# Altium project Riser 812 mod.2.PrjPcb (part 2 of 2)

## Sheet 5 External interface.SchDoc
size 594 x 420 mm; SheetNumber: 6; SheetTotal: 9
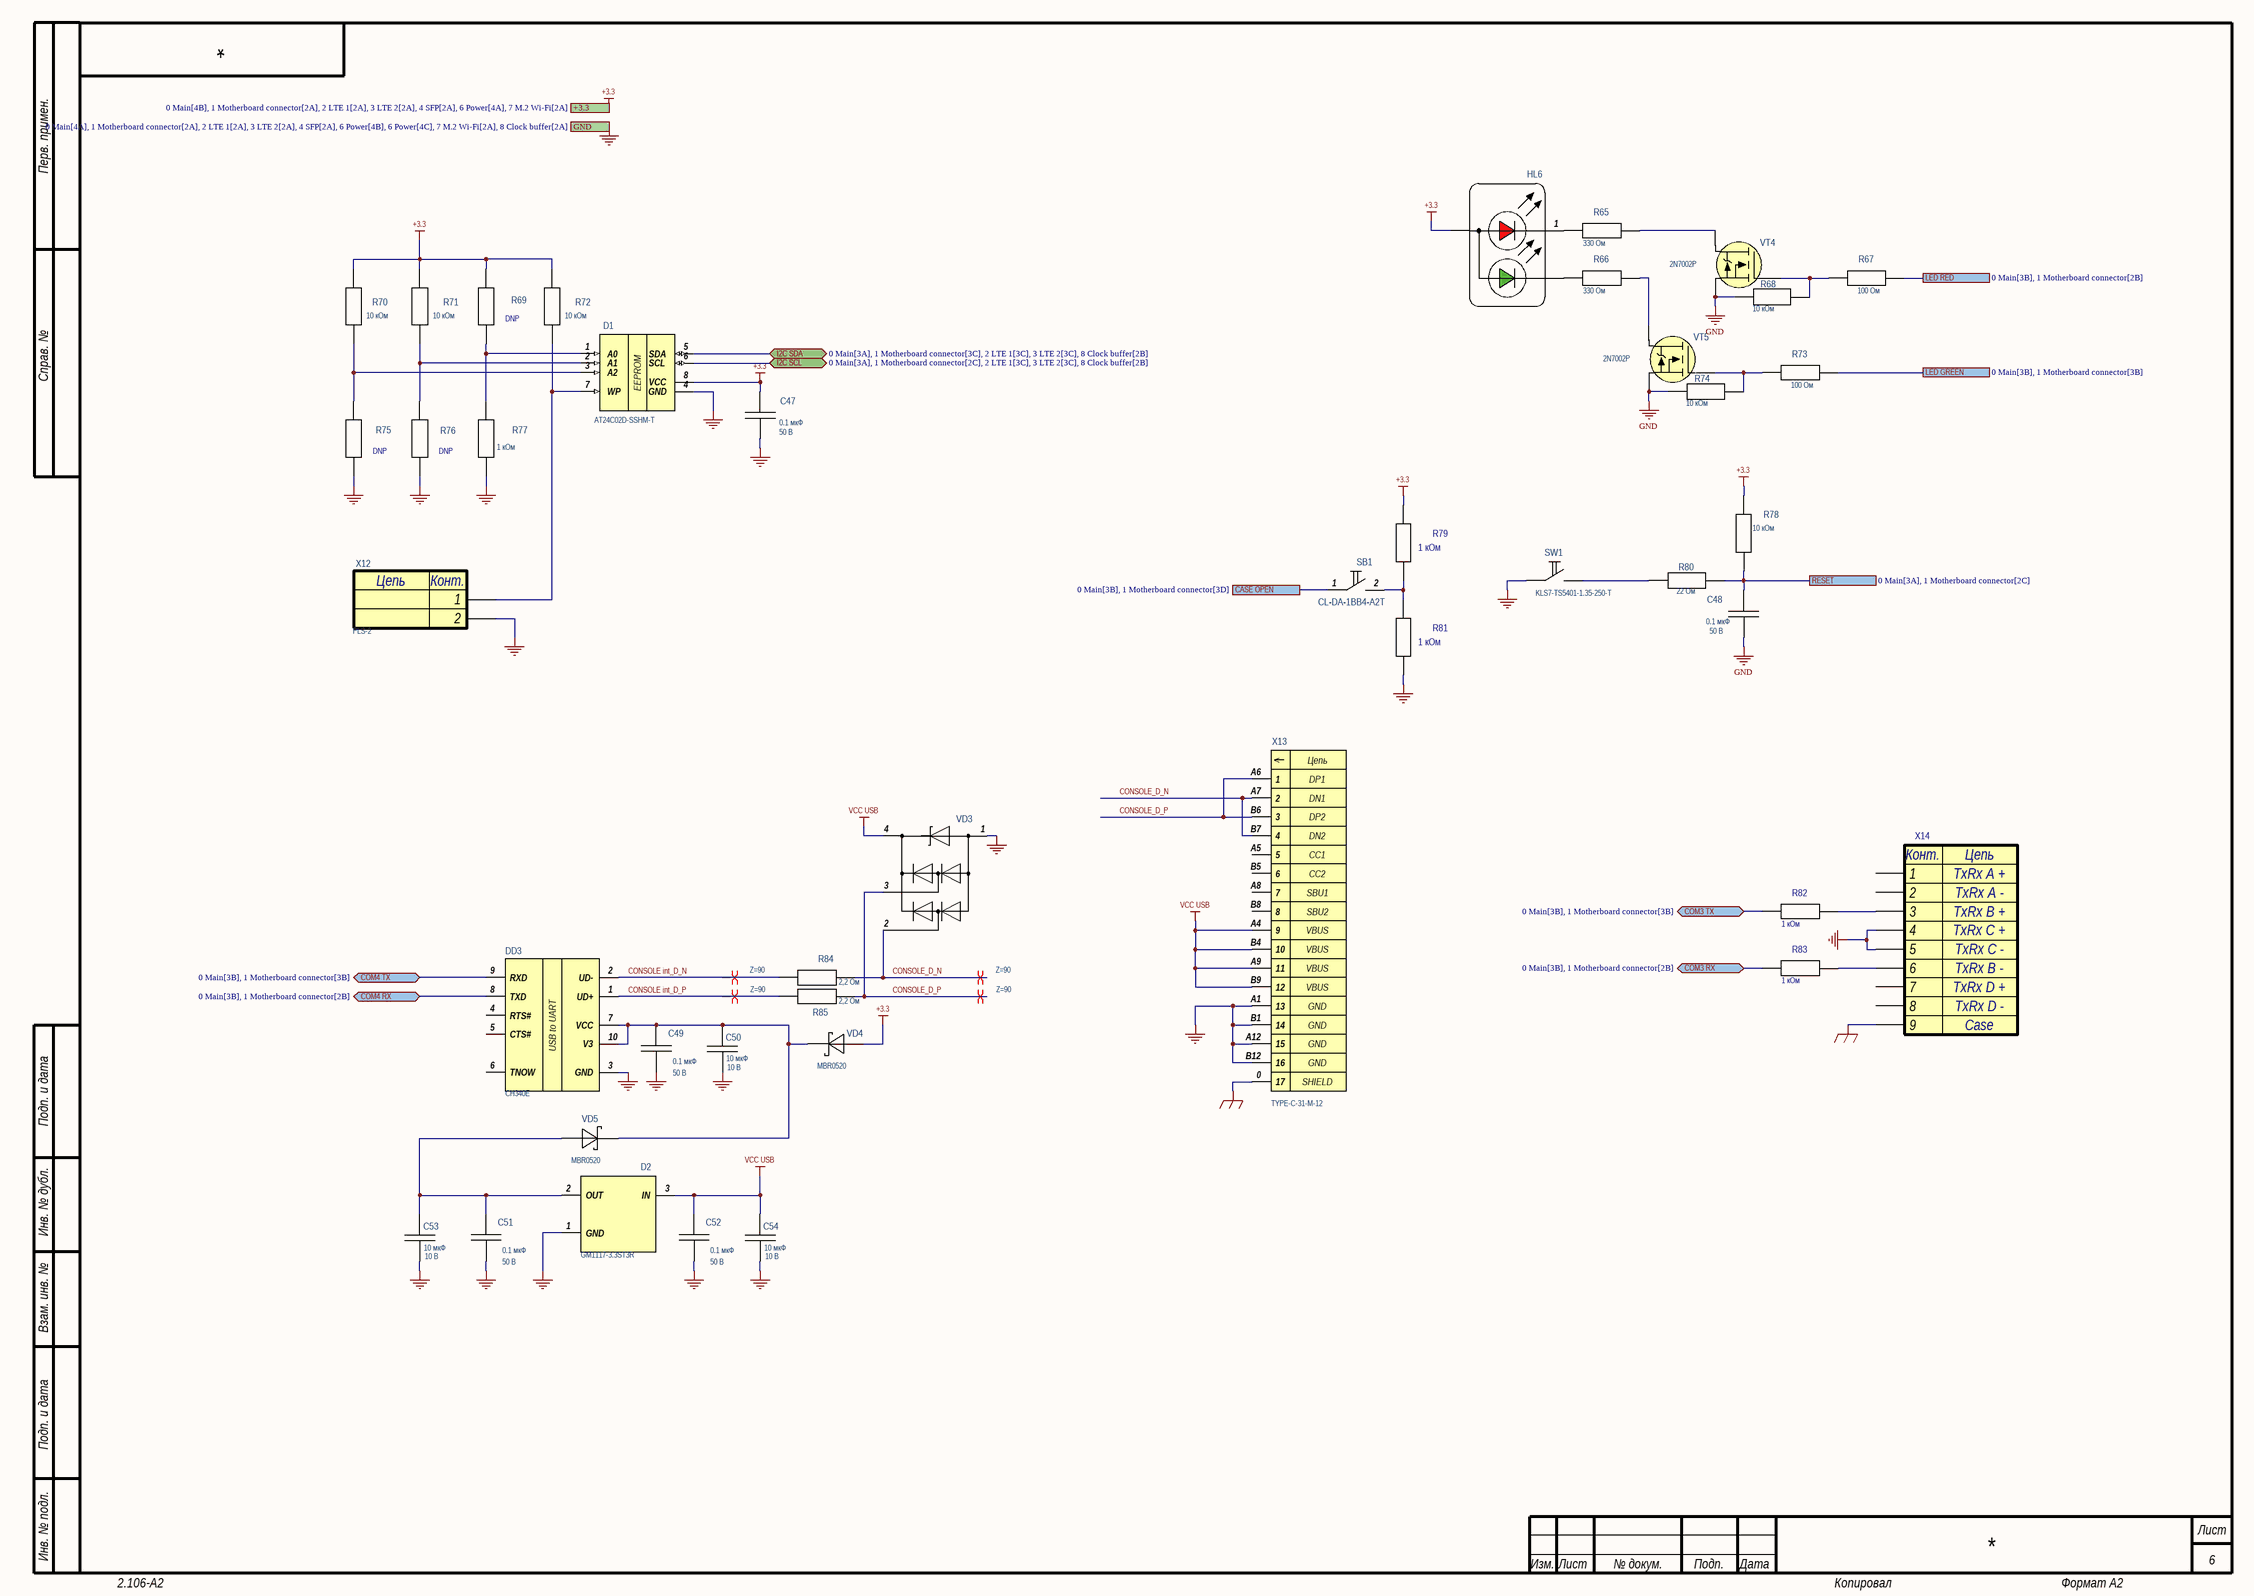
[diagram p5: 5 External interface.SchDoc]

### Parts
C47  value 0.1 мкФ  Напряжение: 50 В  [CAP_0402]
C48  value 0.1 мкФ  Напряжение: 50 В  [CAP_0402]
C49  value 0.1 мкФ  Напряжение: 50 В  [CAP_0402]
C50  value 10 мкФ  Напряжение: 10 В  [CAP_0603]
C51  value 0.1 мкФ  Напряжение: 50 В  [CAP_0402]
C52  value 0.1 мкФ  Напряжение: 50 В  [CAP_0402]
C53  value 10 мкФ  Напряжение: 10 В  [CAP_0603]
C54  value 10 мкФ  Напряжение: 10 В  [CAP_0603]
D1  AT24C02D-SSHM-T  [SOIC-8]
D2  GM1117-3.3ST3R  [SOT-223]
DD3  CH340E  [MSOP-10]
HL6  LTST-S326KGJRKT  [LTST-S326KGJRKT]  (value not drawn)
R65  value 330 Ом  [RES_0402]  (hidden comment: STD_RES)
R66  value 330 Ом  [RES_0402]  (hidden comment: STD_RES)
R67  value 100 Ом  [RES_0402]  (hidden comment: STD_RES)
R68  value 10 кОм  [RES_0402]  (hidden comment: STD_RES)
R69  STD_RES  [RES_0402]  (value not drawn)
R70  value 10 кОм  [RES_0402]  (hidden comment: STD_RES)
R71  value 10 кОм  [RES_0402]  (hidden comment: STD_RES)
R72  value 10 кОм  [RES_0402]  (hidden comment: STD_RES)
R73  value 100 Ом  [RES_0402]  (hidden comment: STD_RES)
R74  value 10 кОм  [RES_0402]  (hidden comment: STD_RES)
R75  STD_RES  [RES_0402]  (value not drawn)
R76  STD_RES  [RES_0402]  (value not drawn)
R77  value 1 кОм  [RES_0402]  (hidden comment: STD_RES)
R78  value 10 кОм  [RES_0402]  (hidden comment: STD_RES)
R79  value 1 кОм  [RES_0402]  (hidden comment: STD_RES)
R80  value 22 Ом  [RES_0402]  (hidden comment: STD_RES)
R81  value 1 кОм  [RES_0402]  (hidden comment: STD_RES)
R82  value 1 кОм  [RES_0402]  (hidden comment: STD_RES)
R83  value 1 кОм  [RES_0402]  (hidden comment: STD_RES)
R84  value 2,2 Ом  [RES_0402]  (hidden comment: STD_RES)
R85  value 2,2 Ом  [RES_0402]  (hidden comment: STD_RES)
SB1  CL-DA-1BB4-A2T  [CL-DA-1BB4-A2T]
SW1  KLS7-TS5401-1.35-250-T  [KLS7-TS5401-1.35-250-T]
VD3  WE05R  [SOT143]  (value not drawn)
VD4  PartNumber: MBR0520  [SOD123]  (hidden comment: STD_DIODE_SCHOTTKY)
VD5  PartNumber: MBR0520  [SOD123]  (hidden comment: STD_DIODE_SCHOTTKY)
VT4  2N7002P  [SOT-23-3]
VT5  2N7002P  [SOT-23-3]
X12  STD_CON2  [PLS-2]  (value not drawn)
X13  TYPE-C-31-M-12  [USB_TYPE_C_16_PIN_TYPE-C-31-M-12]
X14  DS1126-S80BP  [DS1126-S80BP]  (value not drawn)

### Ports
+3.3 (see 0 Main[4B], 1 Motherboard connector[2A], 2 LTE 1[2A], 3 LTE 2[2A], 4 SFP[2A], 6 Power[4A], 7 M.2 Wi-Fi[2A]), CASE OPEN (see 0 Main[3B], 1 Motherboard connector[3D]), COM3 RX (bidir, see 0 Main[3B], 1 Motherboard connector[2B]), COM3 TX (bidir, see 0 Main[3B], 1 Motherboard connector[3B]), COM4 RX (bidir, see 0 Main[3B], 1 Motherboard connector[2B]), COM4 TX (bidir, see 0 Main[3B], 1 Motherboard connector[3B]), GND (see 0 Main[4A], 1 Motherboard connector[2A], 2 LTE 1[2A], 3 LTE 2[2A], 4 SFP[2A], 6 Power[4B], 6 Power[4C], 7 M.2 Wi-Fi[2A], 8 Clock buffer[2A]), I2C SCL (bidir, see 0 Main[3A], 1 Motherboard connector[2C], 2 LTE 1[3C], 3 LTE 2[3C], 8 Clock buffer[2B]), I2C SDA (bidir, see 0 Main[3A], 1 Motherboard connector[3C], 2 LTE 1[3C], 3 LTE 2[3C], 8 Clock buffer[2B]), LED GREEN (see 0 Main[3B], 1 Motherboard connector[3B]), LED RED (see 0 Main[3B], 1 Motherboard connector[2B]), RESET (see 0 Main[3A], 1 Motherboard connector[2C])

### Nets
+3.3: C47.1 D1.8(VCC) HL6.3(A) R69.2 R70.2 R71.2 R72.2 R78.2 R79.1 VD4.2 ; port +3.3
GND: C47.2 C48.2 C49.2 C50.2 C51.2 C52.2 C53.2 C54.2 D1.4(GND) D2.1(GND) DD3.3(GND) R68.1 R74.1 R75.1 R76.1 R77.1 R81.2 SW1.1 VD3.1 VT4.2(S) VT5.2(S) X12.2 X13.A1(13) X13.A12(15) X13.B1(14) X13.B12(16) X14.4 X14.5 ; port GND
GNDG: X13.0(17) X14.9
VCC USB: C52.1 C54.1 D2.3(IN) VD3.4 X13.A4(9) X13.A9(11) X13.B4(10) X13.B9(12)
CONSOLE int_D_N: DD3.2(UD-) R84.1
CONSOLE int_D_P: DD3.1(UD+) R85.1
CONSOLE_D_N: R84.2 VD3.2 X13.A7(2) X13.B7(4)
CONSOLE_D_P: R85.2 VD3.3 X13.A6(1) X13.B6(3)
NetC48_1: C48.1 R78.1 R80.1 ; port RESET
NetC49_1: C49.1 C50.1 DD3.7(VCC) DD3.10(V3) VD4.1 VD5.1
NetC51_1: C51.1 C53.1 D2.2(OUT) VD5.2
NetD1_1: D1.1(A0) R69.1 R77.2
NetD1_2: D1.2(A1) R71.1 R76.2
NetD1_3: D1.3(A2) R70.1 R75.2
NetD1_5: D1.5(SDA) ; port I2C SDA
NetD1_6: D1.6(SCL) ; port I2C SCL
NetD1_7: D1.7(WP) R72.1 X12.1
NetDD3_8: DD3.8(TXD) ; port COM4 RX
NetDD3_9: DD3.9(RXD) ; port COM4 TX
NetHL6_1: HL6.1(K) R65.1
NetHL6_2: HL6.2(K) R66.1
NetR65_2: R65.2 VT4.3(D)
NetR66_2: R66.2 VT5.3(D)
NetR67_1: R67.1 R68.2 VT4.1(G)
NetR67_2: R67.2 ; port LED RED
NetR73_1: R73.1 R74.2 VT5.1(G)
NetR73_2: R73.2 ; port LED GREEN
NetR79_2: R79.2 R81.1 SB1.2
NetR80_2: R80.2 SW1.2
NetR82_1: R82.1 ; port COM3 TX
NetR82_2: R82.2 X14.3
NetR83_1: R83.1 ; port COM3 RX
NetR83_2: R83.2 X14.6
NetSB1_1: SB1.1 ; port CASE OPEN

Not connected (* = marked no-connect by the designer): DD3 4(RTS#) 5(CTS#) 6(TNOW); X13 A5(5) A8(7) B5(6) B8(8); X14 1 2 7 8

### Layout directives
differential pair; differential pair class Z=90: CONSOLE int_D_N, CONSOLE int_D_P, CONSOLE_D_N, CONSOLE_D_P

### Notes on the sheet
- (near R69) DNP
- (near R75) DNP
- (near R76) DNP
- Перв. примен.
- Справ. №
- Подп. и дата
- Инв. № дубл.
- Взам. инв. №
- Инв. № подл.
- Изм.
- Лист
- № докум.
- Подп.
- Дата
- 2.106-A2
- Копировал
- Формат А2
- (in symbol AT24C02D-SSHM-T) EEPROM
- (in symbol DS1126-S80BP) Конт.; Цепь; TxRx A +; TxRx A -; TxRx B +; TxRx C +; TxRx C -; TxRx B -; TxRx D +; TxRx D -; Case
- (in symbol PLS-2) Цепь; Конт.
- (in symbol TYPE-C-31-M-12) Цепь; DP1; DN1; DP2; DN2; CC1; CC2; SBU1; SBU2; VBUS; GND; SHIELD

### Library data of the parts
C47-C49 C51 C52 = CC0402KRX7R9BB104: as C55 on sheet 6 Power; PartNumber: CC0402KRX7R9BB104; Type: CHIP-0402; Tolerance: 10%; Диэлектрик: X7R; Data: 10-04-2024
C50 C53 C54 = GRM188Z71A106KA73D: Конденсатор CHIP-0603 10 мкФ 10 В 10% X7R; Manufacturer: MURATA; ID: 394; Температура: -55...+155°C; Autor: Admin; PartNumber: GRM188Z71A106KA73D; Type: CHIP-0603; Tolerance: 10%; Диэлектрик: X7R; Data: 08-26-2025
D1 = AT24C02D-SSHM-T: Микросхема Atmel  EEPROM 2K I2C 1MHZ; ID: 751; Type: Memory; Voltage: 1.7-3.6В; Current: 3 мА; Температура: -40...+85°C; Autor: Admin; PartNumber: AT24C02D-SSHM-T; Value: EEPROM 2K I2C 1MHZ; Manufacturer: Atmel; Data: 05-31-2024
D2 = GM1117-3.3ST3R: Микросхема Gamma Electronica  1.0 A Low-Dropout LDO; ID: 750; Type: LDOs; Voltage: 3.3В; Current: 1 А; Температура: 0...+125°C; Autor: Admin; PartNumber: GM1117-3.3ST3R; Value: 1.0 A Low-Dropout LDO; Manufacturer: Gamma Electronica; Data: 05-23-2024
DD3 = CH340E: Микросхема MPJA USB to UART; ID: 734; Voltage: 5В; Current: 100 мА; Температура: -40...+85°C; Autor: Admin; Component Type: Микросхема; PartNumber: CH340E; Type: Interfaces; Value: USB to UART; Manufacturer: MPJA; Data: 11-13-2023
HL6 = LTST-S326KGJRKT: Диод LITEON 2 В 30 мА; ID: 122; Type: LED; U_direct: 2 В; U_reverse: 5 В; Current: 30 мА; Температура: -40...+85°C; Autor: Admin; PartNumber: LTST-S326KGJRKT; Manufacturer: LITEON; Data: 01-11-2021
R65 R66 = RC0402FR-07330RL: Резистор CHIP-0402 330 Ом 1%; Manufacturer: YAGEO; ID: 319; ТКС: 100 ppm/K; Температура: -55...+155°C; Autor: Цислав А.Н.; PartNumber: RC0402FR-07330RL; Type: CHIP-0402; Tolerance: 1%; Data: 02-03-2014
R67 R73 = RC0402FR-07100RL: Резистор CHIP-0402 100 Ом 1%; Manufacturer: YAGEO; ID: 298; ТКС: 100 ppm/K; Температура: -55...+155°C; Autor: Цислав А.Н.; PartNumber: RC0402FR-07100RL; Type: CHIP-0402; Tolerance: 1%; Data: 02-03-2014
R68 R70-R72 R74 R78 = RC0402FR-0710KL: Резистор CHIP-0402 10 кОм 1%; Manufacturer: YAGEO; ID: 412; ТКС: 100 ppm/K; Температура: -55...+155°C; Autor: Цислав А.Н.; PartNumber: RC0402FR-0710KL; Type: CHIP-0402; Tolerance: 1%; Data: 02-03-2014
R69 R75 R76 = RC0402FR-0710KL: Резистор CHIP-0402 10 кОм 1%; Manufacturer: YAGEO; ID: 412; Value: 10 кОм; ТКС: 100 ppm/K; Температура: -55...+155°C; Autor: Цислав А.Н.; PartNumber: RC0402FR-0710KL; Type: CHIP-0402; Tolerance: 1%; Data: 02-03-2014
R77 R79 R81 = RC0402FR-071KL: Резистор CHIP-0402 1 кОм 1%; Manufacturer: YAGEO; ID: 337; ТКС: 100 ppm/K; Температура: -55...+155°C; Autor: Цислав А.Н.; PartNumber: RC0402FR-071KL; Type: CHIP-0402; Tolerance: 1%; Data: 02-03-2014
R80 = RC0402FR-0722RL: as R3 on sheet 2 LTE 1; PartNumber: RC0402FR-0722RL; Type: CHIP-0402; Tolerance: 1%; Data: 02-03-2014
R82 R83 = RC0402JR-071KL: Резистор CHIP-0402 1 кОм 5%; Manufacturer: YAGEO; ID: 338; ТКС: 100 ppm/K; Температура: -55...+155°C; Autor: Цислав А.Н.; PartNumber: RC0402JR-071KL; Type: CHIP-0402; Tolerance: 5%; Data: 02-03-2014
R84 R85 = RC0402FR-072R2L: Резистор CHIP-0402 2,2 Ом 1%; Manufacturer: YAGEO; ID: 733; ТКС: 200 ppm/K; Температура: -55...+155°C; Autor: Admin; PartNumber: RC0402FR-072R2L; Type: CHIP-0402; Tolerance: 1%; Data: 11-08-2023
SB1 = CL-DA-1BB4-A2T: Copal Electronics  DETECT SWITCH right angle NC; ID: 98; Voltage: 12 B; Current: 100 мА; Температура: -40...+85°C; Autor: Admin; PartNumber: CL-DA-1BB4-A2T; Type: BUTTON; Value: DETECT SWITCH right angle NC; Manufacturer: Copal Electronics; Data: 05-15-2018
SW1 = KLS7-TS5401-1.35-250-T: KLS Угловая кнопка тактовая SMD; ID: 155; Voltage: 12V; Current: 50 мА; Температура: -30...+70°C; Autor: Admin; PartNumber: KLS7-TS5401-1.35-250-T; Type: BUTTON; Value: Угловая кнопка тактовая SMD; Manufacturer: KLS; Data: 04-09-2024
VD3 = WE05R: Диод WAYON 5 В 5 А; ID: 126; Type: Diode TVS; U_direct: 5 В; Current: 5 А; Температура: -55...+125°C; Autor: Admin; PartNumber: WE05R; U_reverse: 5 В; Manufacturer: WAYON; Data: 12-08-2023
VD4 VD5 = MBR0520: Диод IR 500 мВ 500 мА; ID: 33; Type: Diode Schottky; U_direct: 500 мВ; U_reverse: 20 В; Current: 500 мА; Температура: -40...+85°C; Autor: Admin; Manufacturer: IR; Data: 10-22-2015
VT4 VT5 = 2N7002P: Микросхема NXP  N-channel Trench MOSFET; ID: 321; Type: MOSFET N-Channel; Voltage: 60В; Current: 300 мА; Температура: -40...+85°C; Autor: Admin; PartNumber: 2N7002P; Value: N-channel Trench MOSFET; Manufacturer: NXP; Data: 05-24-2016
X12 = PLS-2: Разъем NoName PLS; ID: 2; Pitch: 2.54 мм; Current: 2 А; Autor: Admin; PartNumber: PLS-2; Type: PLS; Contact: 2; Mounting: Сквозной; Manufacturer: NoName; Data: 09-04-2013
X13 = TYPE-C-31-M-12: Разъем Hroparts Electronics USB; ID: 375; Contact: 14; Pitch: 0.5 мм; Current: 1 А; Autor: Admin; PartNumber: TYPE-C-31-M-12; Type: USB; Mounting: Поверхностный; Manufacturer: Hroparts Electronics; Data: 05-13-2024
X14 = DS1126-S80BP: Разъем Connfly LAN; ID: 364; Contact: 8; Pitch: 1.27 мм; Current: 1 А; Autor: Admin; PartNumber: DS1126-S80BP; Type: LAN; Mounting: Сквозной; Manufacturer: Connfly; Data: 04-04-2024

## Sheet 1 Motherboard connector.SchDoc
size 420 x 297 mm; SheetNumber: 2; SheetTotal: 9
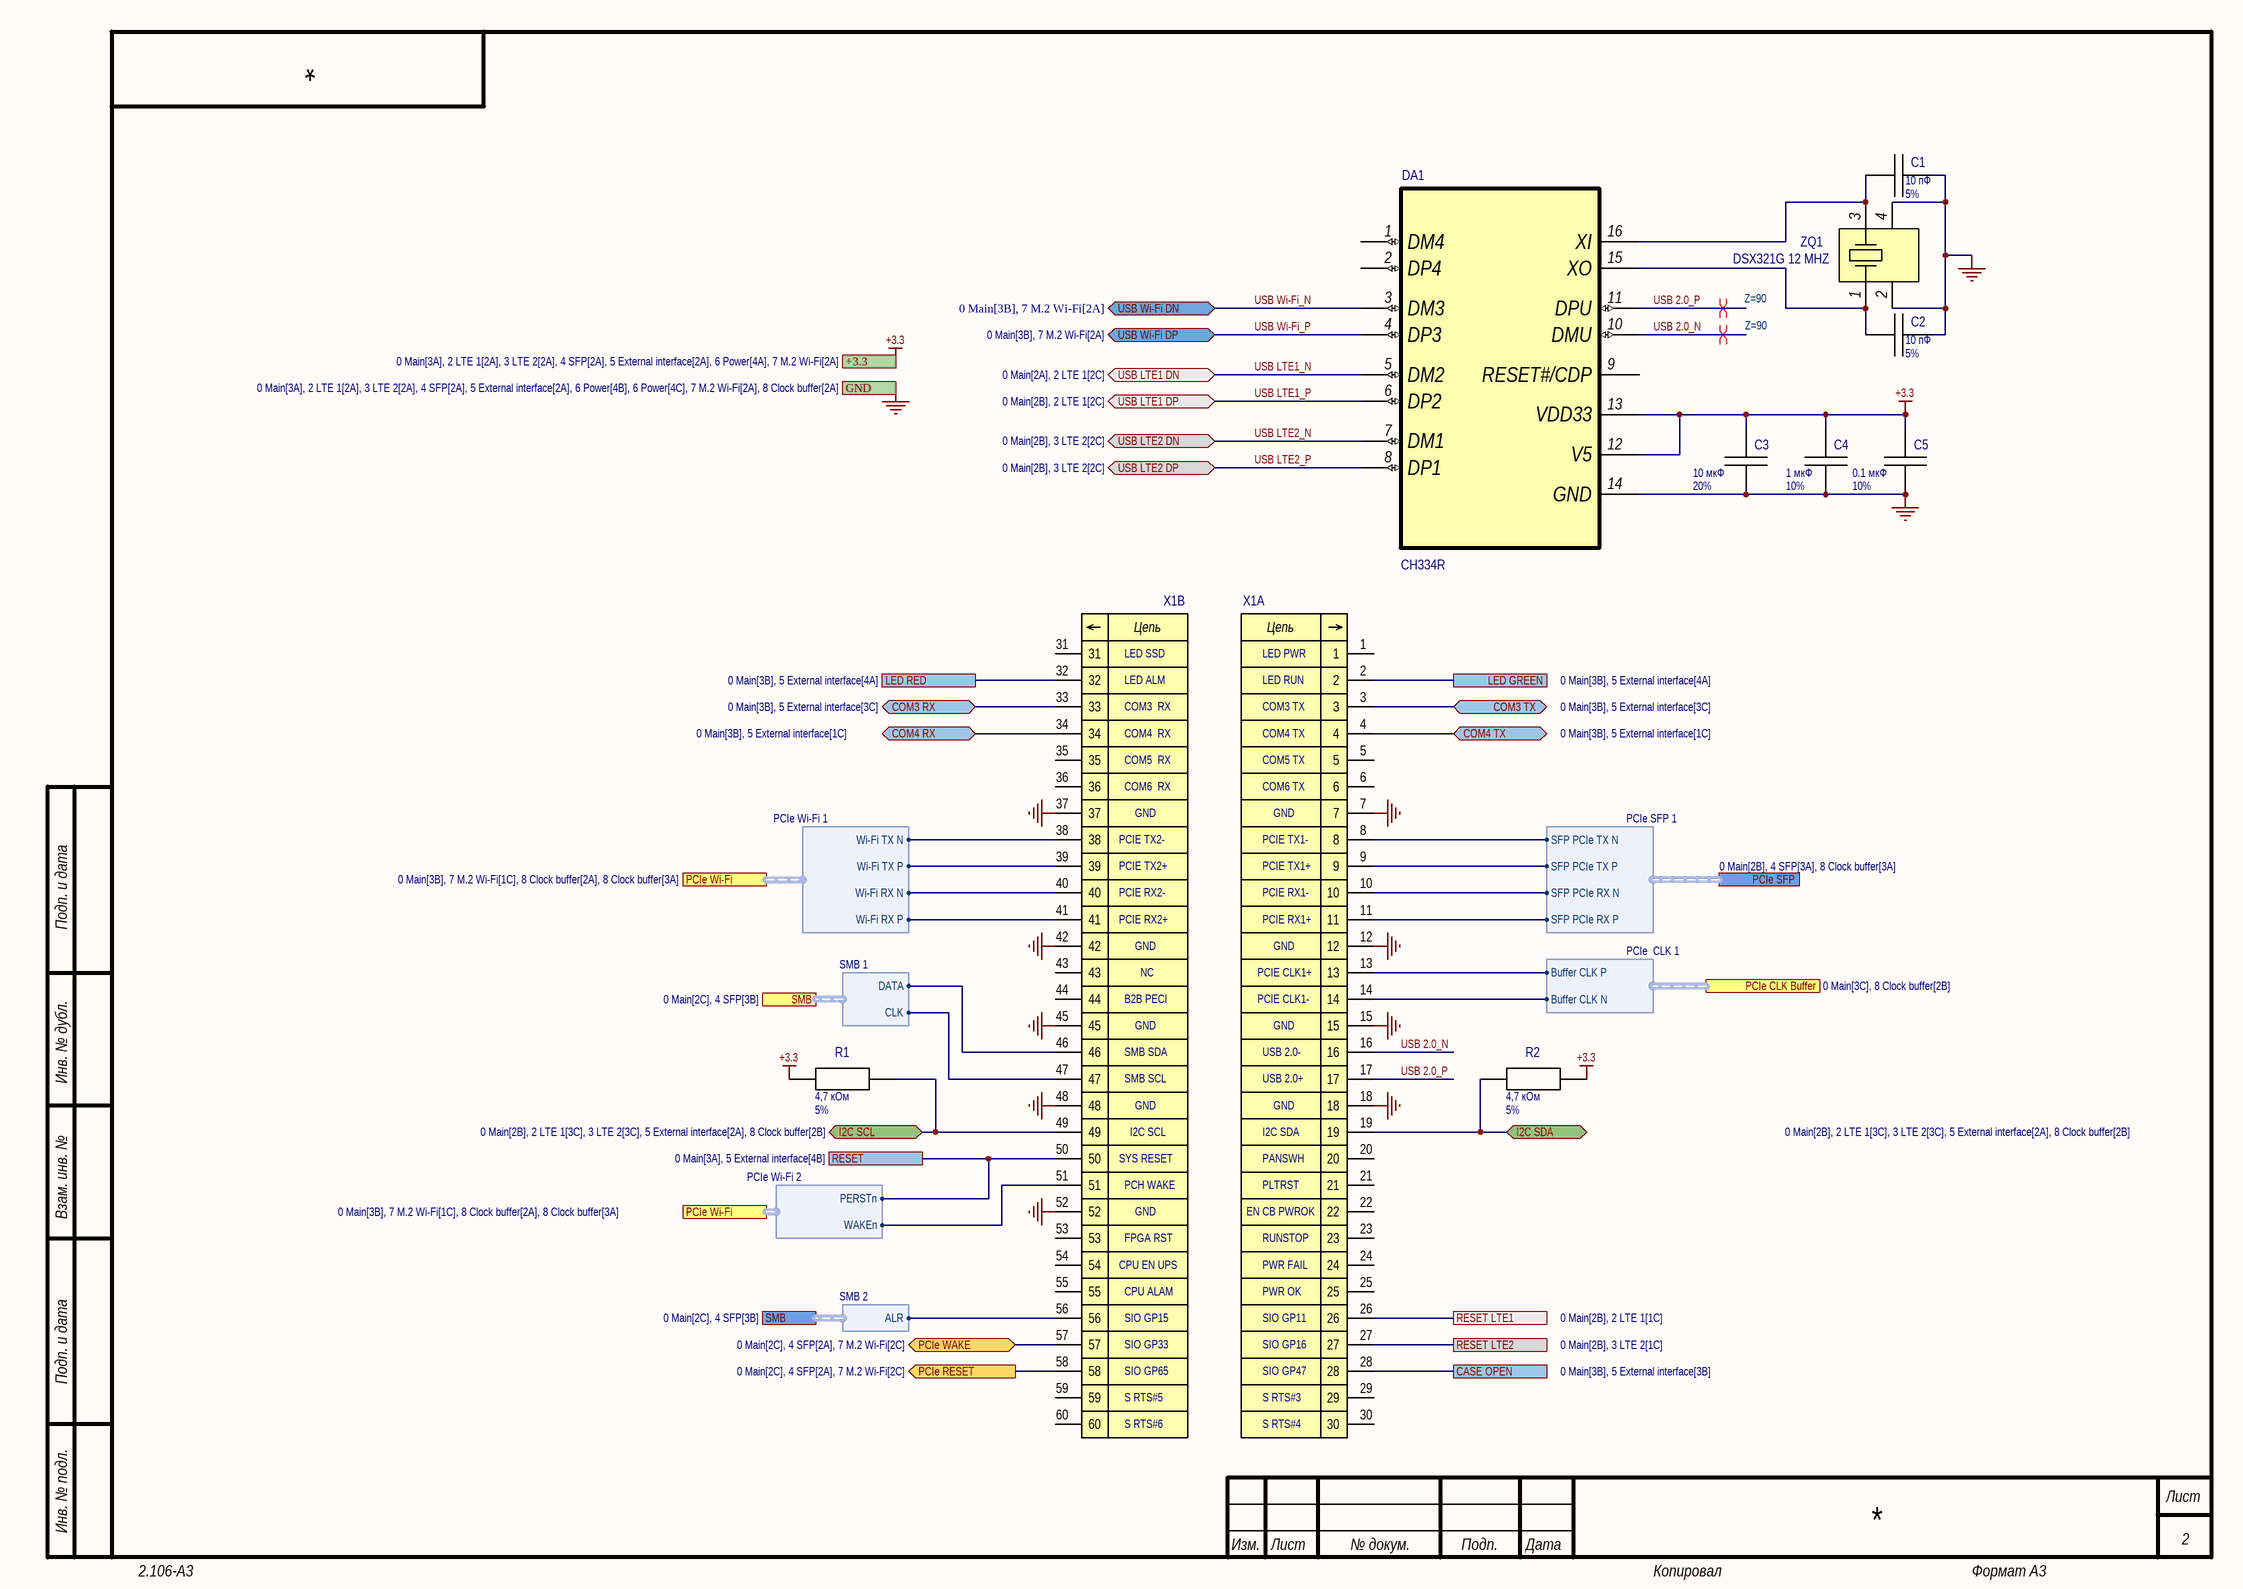
[diagram p6: 1 Motherboard connector.SchDoc]

### Parts
C1  value 10 пФ  Tolerance: 5%  [CAP_0402]
C2  value 10 пФ  Tolerance: 5%  [CAP_0402]
C3  value 10 мкФ  Tolerance: 20%  [CAP_0402_BIG]
C4  value 1 мкФ  Tolerance: 10%  [CAP_0402]
C5  value 0.1 мкФ  Tolerance: 10%  [CAP_0402]
DA1  CH334R  [QSOP-16]
R1  value 4,7 кОм  Tolerance: 5%  [RES_0402]  (hidden comment: STD_RES)
R2  value 4,7 кОм  Tolerance: 5%  [RES_0402]  (hidden comment: STD_RES)
X1  123053-606050-HF  [123053-606050-HF]  (value not drawn)  (parts A,B of 2)
ZQ1  DSX321G 12 MHZ  [3,5x2,5]

### Ports
+3.3 (see 0 Main[3A], 2 LTE 1[2A], 3 LTE 2[2A], 4 SFP[2A], 5 External interface[2A], 6 Power[4A], 7 M.2 Wi-Fi[2A]), CASE OPEN (see 0 Main[3B], 5 External interface[3B]), COM3 RX (bidir, see 0 Main[3B], 5 External interface[3C]), COM3 TX (bidir, see 0 Main[3B], 5 External interface[3C]), COM4 RX (bidir, see 0 Main[3B], 5 External interface[1C]), COM4 TX (bidir, see 0 Main[3B], 5 External interface[1C]), GND (see 0 Main[3A], 2 LTE 1[2A], 3 LTE 2[2A], 4 SFP[2A], 5 External interface[2A], 6 Power[4B], 6 Power[4C], 7 M.2 Wi-Fi[2A], 8 Clock buffer[2A]), I2C SCL (bidir, see 0 Main[2B], 2 LTE 1[3C], 3 LTE 2[3C], 5 External interface[2A], 8 Clock buffer[2B]), I2C SDA (bidir, see 0 Main[2B], 2 LTE 1[3C], 3 LTE 2[3C], 5 External interface[2A], 8 Clock buffer[2B]), LED GREEN (see 0 Main[3B], 5 External interface[4A]), LED RED (see 0 Main[3B], 5 External interface[4A]), PCIe CLK Buffer (harness PCIe  CLK 1, see 0 Main[3C], 8 Clock buffer[2B]), PCIe RESET (out, see 0 Main[2C], 4 SFP[2A], 7 M.2 Wi-Fi[2C]), PCIe SFP (harness PCIe SFP 1, see 0 Main[2B], 4 SFP[3A], 8 Clock buffer[3A]), PCIe WAKE (bidir, see 0 Main[2C], 4 SFP[2A], 7 M.2 Wi-Fi[2C]), PCIe Wi-Fi (harness PCIe Wi-Fi 1, see 0 Main[3B], 7 M.2 Wi-Fi[1C], 8 Clock buffer[2A], 8 Clock buffer[3A]), PCIe Wi-Fi (harness PCIe Wi-Fi 2, see 0 Main[3B], 7 M.2 Wi-Fi[1C], 8 Clock buffer[2A], 8 Clock buffer[3A]), RESET (see 0 Main[3A], 5 External interface[4B]), RESET LTE1 (see 0 Main[2B], 2 LTE 1[1C]), RESET LTE2 (see 0 Main[2B], 3 LTE 2[1C]), SMB (harness SMB 1, see 0 Main[2C], 4 SFP[3B]), SMB (harness SMB 2, see 0 Main[2C], 4 SFP[3B]), USB LTE1 DN (bidir, see 0 Main[2A], 2 LTE 1[2C]), USB LTE1 DP (bidir, see 0 Main[2B], 2 LTE 1[2C]), USB LTE2 DN (bidir, see 0 Main[2B], 3 LTE 2[2C]), USB LTE2 DP (bidir, see 0 Main[2B], 3 LTE 2[2C]), USB Wi-Fi DN (bidir, see 0 Main[3B], 7 M.2 Wi-Fi[2A]), USB Wi-Fi DP (bidir, see 0 Main[3B], 7 M.2 Wi-Fi[2A])

### Harnesses
SMB 1: DATA, CLK
SMB 2: ALR
PCIe Wi-Fi 1: Wi-Fi TX P, Wi-Fi TX N, Wi-Fi RX P, Wi-Fi RX N
PCIe Wi-Fi 2: WAKEn, PERSTn
PCIe  CLK 1: Buffer CLK P, Buffer CLK N
PCIe SFP 1: SFP PCIe RX P, SFP PCIe RX N, SFP PCIe TX P, SFP PCIe TX N

### Nets
+3.3: C3.1 C4.1 C5.1 DA1.12(V5) DA1.13(VDD33) R1.2 R2.2 ; port +3.3
GND: C1.2 C2.2 C3.2 C4.2 C5.2 DA1.14(GND) X1.7 X1.12 X1.15 X1.18 X1.37 X1.42 X1.45 X1.48 X1.52 ZQ1.2 ZQ1.4 ; port GND
Buffer PCIE CLK_N: X1.14 ; port PCIe CLK Buffer.Buffer CLK N
Buffer PCIE CLK_P: X1.13 ; port PCIe CLK Buffer.Buffer CLK P
SFP RX INT_N: X1.10 ; port PCIe SFP.SFP PCIe RX N
SFP RX INT_P: X1.11 ; port PCIe SFP.SFP PCIe RX P
SFP TX INT_N: X1.8 ; port PCIe SFP.SFP PCIe TX N
SFP TX INT_P: X1.9 ; port PCIe SFP.SFP PCIe TX P
USB 2.0_N: DA1.10(DMU) X1.16
USB 2.0_P: DA1.11(DPU) X1.17
USB LTE1_N: DA1.5(DM2) ; port USB LTE1 DN
USB LTE1_P: DA1.6(DP2) ; port USB LTE1 DP
USB LTE2_N: DA1.7(DM1) ; port USB LTE2 DN
USB LTE2_P: DA1.8(DP1) ; port USB LTE2 DP
USB Wi-Fi_N: DA1.3(DM3) ; port USB Wi-Fi DN
USB Wi-Fi_P: DA1.4(DP3) ; port USB Wi-Fi DP
Wi-Fi PCIe RX_N: X1.40 ; port PCIe Wi-Fi.Wi-Fi RX N
Wi-Fi PCIe RX_P: X1.41 ; port PCIe Wi-Fi.Wi-Fi RX P
Wi-Fi PCIe TX int_N: X1.38 ; port PCIe Wi-Fi.Wi-Fi TX N
Wi-Fi PCIe TX int_P: X1.39 ; port PCIe Wi-Fi.Wi-Fi TX P
NetC1_1: C1.1 DA1.16(XI) ZQ1.3
NetC2_1: C2.1 DA1.15(XO) ZQ1.1
NetC48_1: X1.50 X1.58 ; port RESET, port PCIe RESET, port PCIe Wi-Fi.PERSTn
NetD1_5: R2.1 X1.19 ; port I2C SDA
NetD1_6: R1.1 X1.49 ; port I2C SCL
NetDD1_16: X1.51 X1.57 ; port PCIe WAKE, port PCIe Wi-Fi.WAKEn
NetDD1_34: X1.47 ; port SMB.CLK
NetDD1_35: X1.56 ; port SMB.ALR
NetDD1_36: X1.46 ; port SMB.DATA
NetDD3_8: X1.34 ; port COM4 RX
NetDD3_9: X1.4 ; port COM4 TX
NetR8_1: X1.26 ; port RESET LTE1
NetR18_1: X1.27 ; port RESET LTE2
NetR67_2: X1.32 ; port LED RED
NetR73_2: X1.2 ; port LED GREEN
NetR82_1: X1.3 ; port COM3 TX
NetR83_1: X1.33 ; port COM3 RX
NetSB1_1: X1.28 ; port CASE OPEN

Not connected (* = marked no-connect by the designer): DA1 1(DM4) 2(DP4) 9(RESET#/CDP); X1 1 5 6 20 21 22 23 24 25 29 30 31 35 36 43 44 53 54 55 59 60

### Layout directives
differential pair; differential pair class Z=90: USB 2.0_N, USB 2.0_P

### Notes on the sheet
- (near X1) LED SSD
- (near X1) LED PWR
- (near X1) LED ALM
- (near X1) COM3  RX
- (near X1) LED RUN
- (near X1) COM3 TX
- (near X1) COM4  RX
- (near X1) COM5  RX
- (near X1) COM6  RX
- (near X1) COM4 TX
- (near X1) COM5 TX
- (near X1) COM6 TX
- (near X1) PCIE TX2-
- (near X1) PCIE TX2+
- (near X1) GND
- (near X1) PCIE TX1-
- (near X1) PCIE TX1+
- GND
- (near X1) PCIE RX2-
- (near X1) PCIE RX2+
- (near X1) PCIE RX1-
- (near X1) PCIE RX1+
- (near X1) B2B PECI
- NC
- (near X1) PCIE CLK1+
- (near X1) PCIE CLK1-
- (near X1) SMB SDA
- (near X1) USB 2.0-
- (near X1) SMB SCL
- (near X1) I2C SCL
- (near X1) USB 2.0+
- (near X1) I2C SDA
- (near X1) SYS RESET
- (near X1) PCH WAKE
- (near X1) PANSWH
- (near X1) PLTRST
- (near X1) CPU EN UPS
- (near X1) FPGA RST
- (near X1) EN CB PWROK
- (near X1) RUNSTOP
- (near X1) PWR FAIL
- (near X1) CPU ALAM
- (near X1) SIO GP15
- (near X1) PWR OK
- (near X1) SIO GP11
- (near X1) SIO GP33
- (near X1) SIO GP65
- (near X1) S RTS#5
- (near X1) SIO GP16
- (near X1) SIO GP47
- (near X1) S RTS#3
- (near X1) S RTS#6
- (near X1) S RTS#4
- Подп. и дата
- Инв. № дубл.
- Взам. инв. №
- Инв. № подл.
- Изм.
- Лист
- № докум.
- Подп.
- Дата
- 2.106-A3
- Копировал
- Формат А3
- (in symbol 123053-606050-HF, part A) Цепь
- (in symbol 123053-606050-HF, part B) Цепь

### Library data of the parts
C1 C2 = CC0402JRNPO9BN100: Конденсатор CHIP-0402 10 пФ 50 В 5% NPO; Manufacturer: YAGEO; ID: 86; Напряжение: 50 В; Температура: -55...+85°C; Autor: Цислав А.Н.; PartNumber: CC0402JRNPO9BN100; Type: CHIP-0402; Диэлектрик: NPO; Data: 09-05-2013
C3 = CC0402MRX5R5BB106: Конденсатор CHIP-0402 10 мкФ 6.3 В 20% X5R; Manufacturer: YAGEO; ID: 340; Напряжение: 6.3 В; Температура: -55...+85°C; Autor: Admin; PartNumber: CC0402MRX5R5BB106; Type: CHIP-0402; Диэлектрик: X5R; Data: 02-12-2025
C4 = GRM155R61E105KA12D: Конденсатор CHIP-0402 1 мкФ 25 В 10% X5R; Manufacturer: YAGEO; ID: 337; Напряжение: 25 В; Температура: -55...+85°C; Autor: Admin; PartNumber: GRM155R61E105KA12D; Type: CHIP-0402; Диэлектрик: X5R; Data: 10-30-2023
C5 = CC0402KRX7R7BB104: Конденсатор CHIP-0402 0.1 мкФ 16 В 10% X7R; Manufacturer: YAGEO; ID: 26; Напряжение: 16 В; Температура: -55...+85°C; Autor: Admin; PartNumber: CC0402KRX7R7BB104; Type: CHIP-0402; Диэлектрик: X7R; Data: 08-29-2013
DA1 = CH334R: Микросхема WCH USB HUB  1-4 port; ID: 746; Voltage: 5В; Current: 50 мА; Температура: -40...+85°C; Autor: Admin; PartNumber: CH334R; Type: Interfaces; Value: USB HUB  1-4 port; Manufacturer: WCH; Data: 04-23-2024
R1 R2 = RC0402JR-074K7L: Резистор CHIP-0402 4,7 кОм 5%; Manufacturer: YAGEO; ID: 382; ТКС: 100 ppm/K; Температура: -55...+155°C; Autor: Цислав А.Н.; PartNumber: RC0402JR-074K7L; Type: CHIP-0402; Data: 02-03-2014
X1 = 123053-606050-HF: Разъем BEIJIDA ELECTRONICS TECHNOLOGY Board-to-Board; ID: 480; Contact: 60; Pitch: 0.5 мм; Current: 1 А; Autor: Admin; PartNumber: 123053-606050-HF; Type: Board-to-Board; Mounting: Поверхностный; Manufacturer: BEIJIDA ELECTRONICS TECHNOLOGY; Data: 08-11-2025
ZQ1 = DSX321G 12 MHZ: Микросхема KSE   Quartz Cristal 12.0 MHz ±30ppm; ID: 739; Температура: -40...+85°C; Autor: Admin; PartNumber: DSX321G 12 MHZ; Type: Clocks; Value: Quartz Cristal 12.0 MHz ±30ppm; Voltage: -; Current: -; Manufacturer: KSE; Data: 05-03-2024

## Sheet 7 M.2 Wi-Fi.SchDoc
size 594 x 420 mm; SheetNumber: 8; SheetTotal: 9
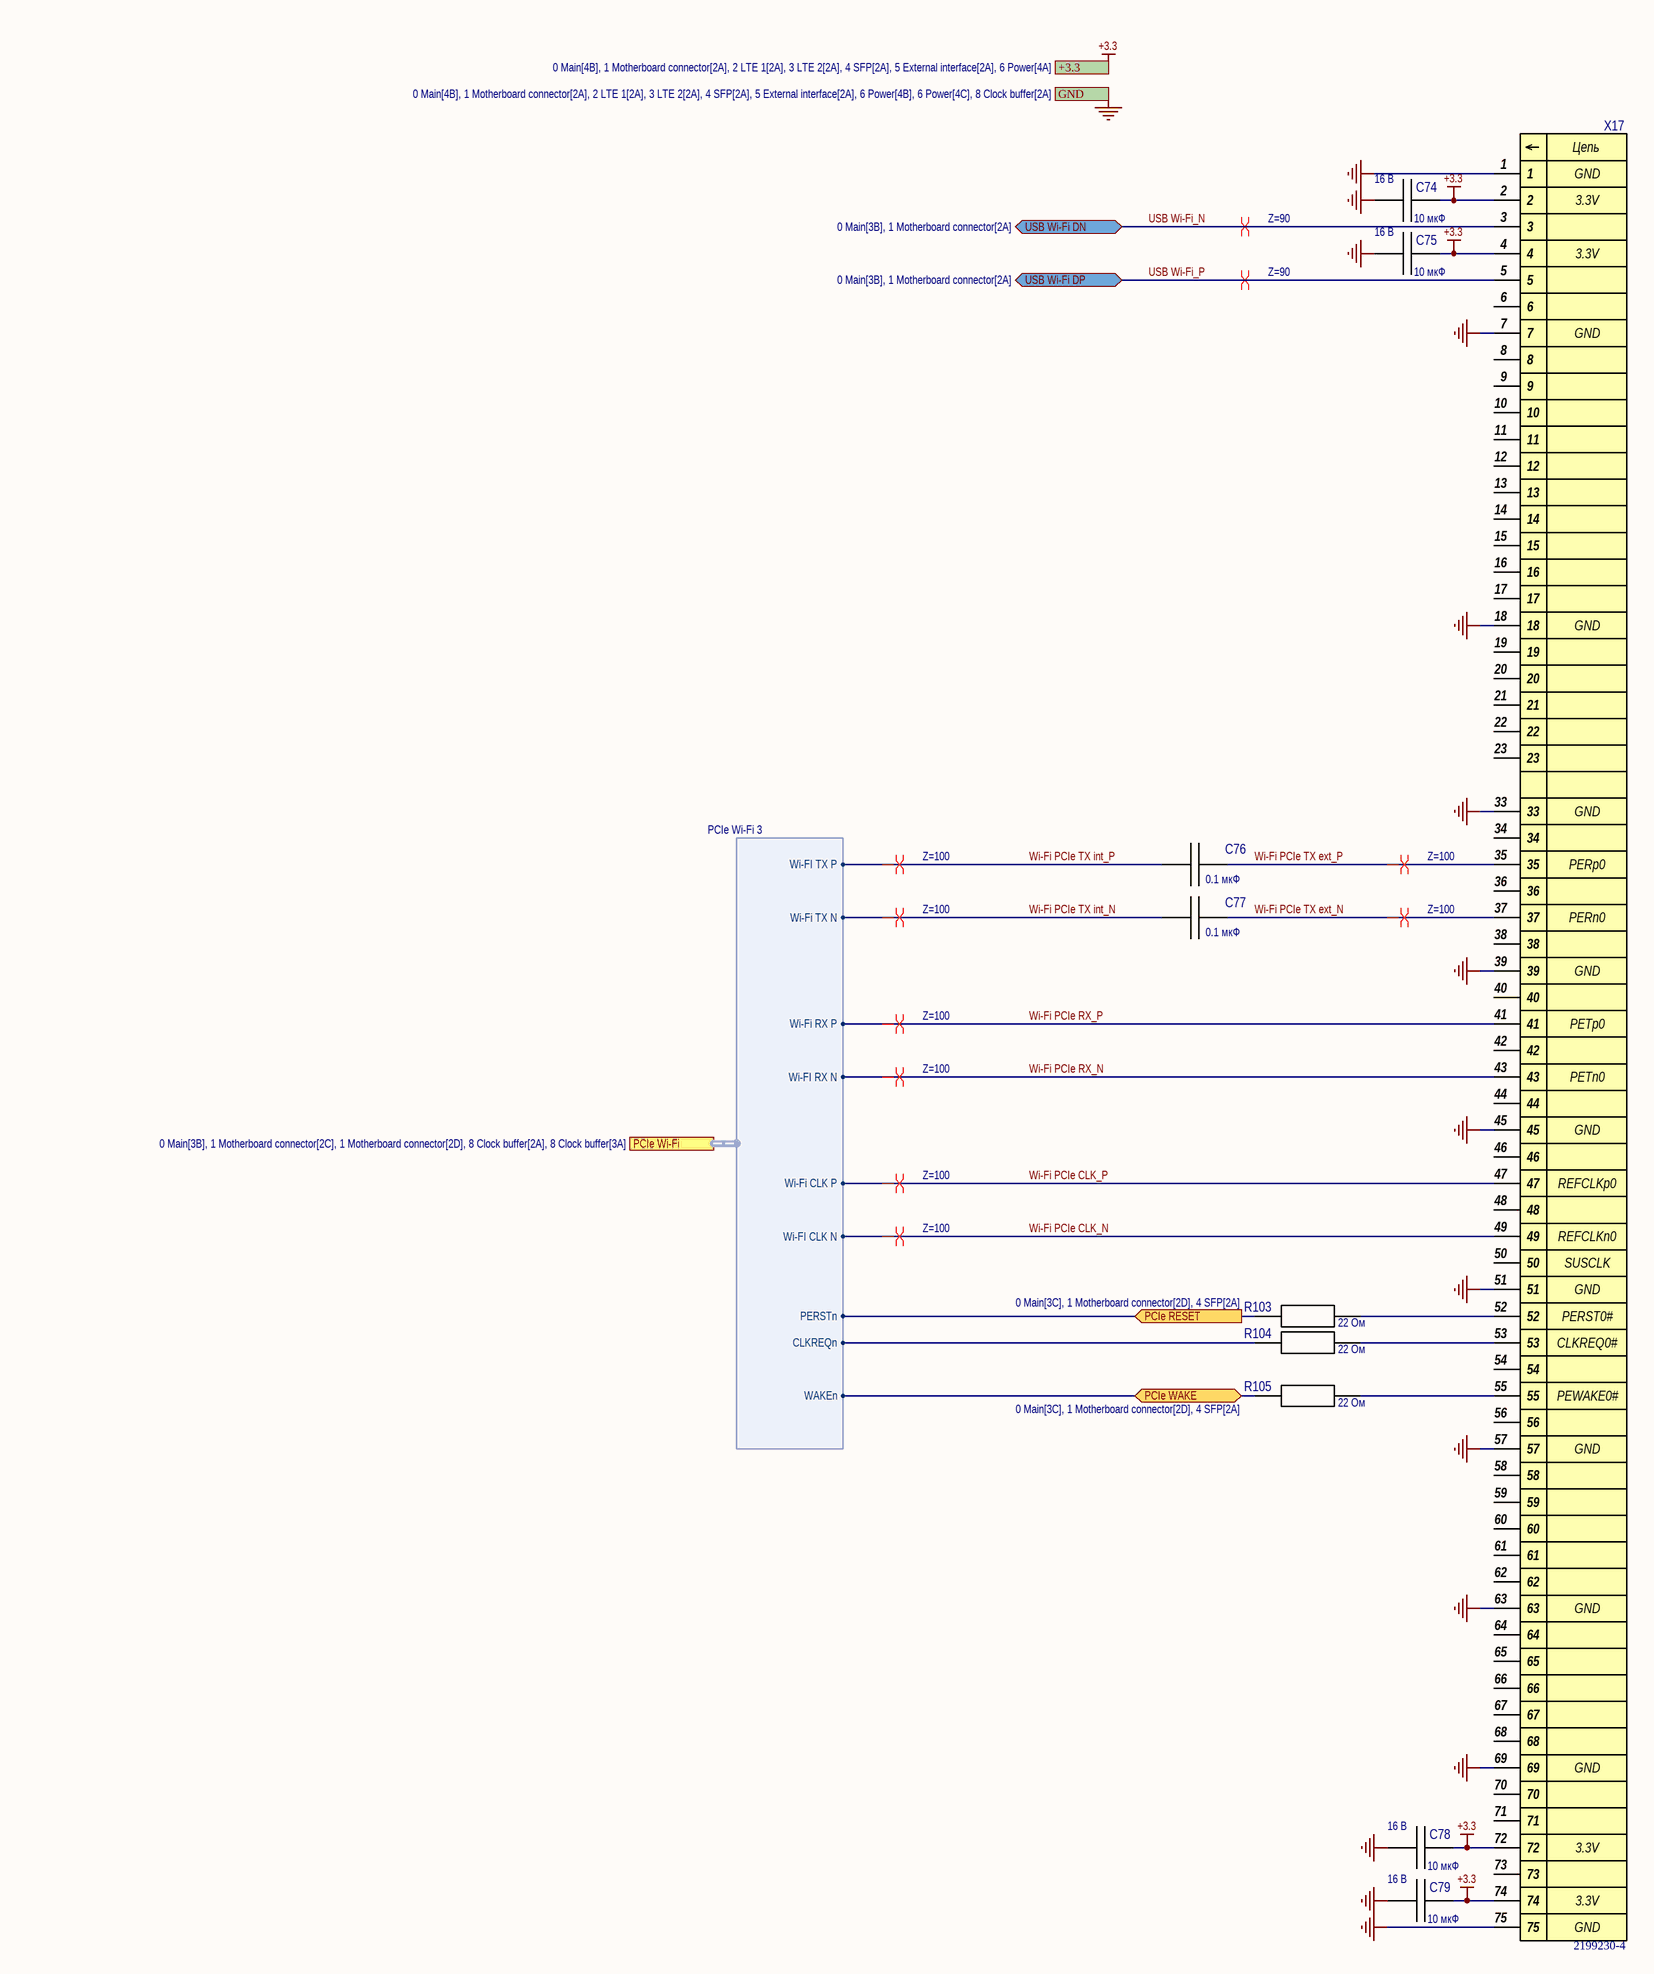
[diagram p7: 7 M.2 Wi-Fi.SchDoc]

### Parts
C74  value 10 мкФ  Напряжение: 16 В  [CAP_0805]
C75  value 10 мкФ  Напряжение: 16 В  [CAP_0805]
C76  value 0.1 мкФ  [CAP_0402]
C77  value 0.1 мкФ  [CAP_0402]
C78  value 10 мкФ  Напряжение: 16 В  [CAP_0805]
C79  value 10 мкФ  Напряжение: 16 В  [CAP_0805]
R103  value 22 Ом  [RES_0402]  (hidden comment: STD_RES)
R104  value 22 Ом  [RES_0402]  (hidden comment: STD_RES)
R105  value 22 Ом  [RES_0402]  (hidden comment: STD_RES)
X17  2199230-4  [2199230-4]

### Ports
+3.3 (see 0 Main[4B], 1 Motherboard connector[2A], 2 LTE 1[2A], 3 LTE 2[2A], 4 SFP[2A], 5 External interface[2A], 6 Power[4A]), GND (see 0 Main[4B], 1 Motherboard connector[2A], 2 LTE 1[2A], 3 LTE 2[2A], 4 SFP[2A], 5 External interface[2A], 6 Power[4B], 6 Power[4C], 8 Clock buffer[2A]), PCIe RESET (in, see 0 Main[3C], 1 Motherboard connector[2D], 4 SFP[2A]), PCIe WAKE (bidir, see 0 Main[3C], 1 Motherboard connector[2D], 4 SFP[2A]), PCIe Wi-Fi (harness PCIe Wi-Fi 3, see 0 Main[3B], 1 Motherboard connector[2C], 1 Motherboard connector[2D], 8 Clock buffer[2A], 8 Clock buffer[3A]), USB Wi-Fi DN (bidir, see 0 Main[3B], 1 Motherboard connector[2A]), USB Wi-Fi DP (bidir, see 0 Main[3B], 1 Motherboard connector[2A])

### Harnesses
PCIe Wi-Fi 3: Wi-FI TX P, Wi-Fi TX N, Wi-Fi RX P, Wi-FI RX N, Wi-Fi CLK P, Wi-FI CLK N, PERSTn, CLKREQn, WAKEn

### Nets
+3.3: C74.1 C75.1 C78.1 C79.1 X17.2 X17.4 X17.72 X17.74 ; port +3.3
GND: C74.2 C75.2 C78.2 C79.2 X17.1 X17.7 X17.18 X17.33 X17.39 X17.45 X17.51 X17.57 X17.63 X17.69 X17.75 ; port GND
PD#: R104.2 ; port PCIe Wi-Fi.CLKREQn
USB Wi-Fi_N: X17.3 ; port USB Wi-Fi DN
USB Wi-Fi_P: X17.5 ; port USB Wi-Fi DP
Wi-Fi PCIe CLK_N: X17.49 ; port PCIe Wi-Fi.Wi-FI CLK N
Wi-Fi PCIe CLK_P: X17.47 ; port PCIe Wi-Fi.Wi-Fi CLK P
Wi-Fi PCIe RX_N: X17.43 ; port PCIe Wi-Fi.Wi-FI RX N
Wi-Fi PCIe RX_P: X17.41 ; port PCIe Wi-Fi.Wi-Fi RX P
Wi-Fi PCIe TX ext_N: C77.1 X17.37
Wi-Fi PCIe TX ext_P: C76.1 X17.35
Wi-Fi PCIe TX int_N: C77.2 ; port PCIe Wi-Fi.Wi-Fi TX N
Wi-Fi PCIe TX int_P: C76.2 ; port PCIe Wi-Fi.Wi-FI TX P
NetC48_1: R103.2 ; port PCIe RESET, port PCIe Wi-Fi.PERSTn
NetDD1_16: R105.2 ; port PCIe WAKE, port PCIe Wi-Fi.WAKEn
NetR103_1: R103.1 X17.52
NetR104_1: R104.1 X17.53
NetR105_1: R105.1 X17.55

Not connected (* = marked no-connect by the designer): X17 6 8 9 10 11 12 13 14 15 16 17 19 20 21 22 23 34 36 38 40 42 44 46 48 50 54 56 58 59 60 61 62 64 65 66 67 68 70 71 73

### Layout directives
differential pair; differential pair class Z=90: USB Wi-Fi_N, USB Wi-Fi_P
differential pair; differential pair class Z=100: Wi-Fi PCIe CLK_N, Wi-Fi PCIe CLK_P, Wi-Fi PCIe RX_N, Wi-Fi PCIe RX_P, Wi-Fi PCIe TX ext_N, Wi-Fi PCIe TX ext_P, Wi-Fi PCIe TX int_N, Wi-Fi PCIe TX int_P

### Notes on the sheet
- Перв. примен.
- Справ. №
- Подп. и дата
- Инв. № дубл.
- Взам. инв. №
- Инв. № подл.
- Изм.
- Лист
- № докум.
- Подп.
- Дата
- 2.106-A2
- Копировал
- Формат А2
- (in symbol 2199230-4) Цепь; GND; 3.3V; PERp0; PERn0; PETp0; PETn0; REFCLKp0; REFCLKn0; SUSCLK; PERST0#; CLKREQ0#; PEWAKE0#

### Library data of the parts
C74 C75 C78 C79 = GRM21BR61C106KE15L: Конденсатор CHIP-0805 10 мкФ 16 В 10% X5R; Manufacturer: MURATA; ID: 121; Температура: -55...+85°C; Autor: Цислав А.Н.; PartNumber: GRM21BR61C106KE15L; Type: CHIP-0805; Tolerance: 10%; Диэлектрик: X5R; Data: 09-05-2013
C76 C77 = GRM155R71E104KE14: Конденсатор CHIP-0402 0.1 мкФ 25 В 10% X7R; Manufacturer: MURATA; ID: 234; Напряжение: 25 В; Температура: -55...+125°C; Autor: Admin; PartNumber: GRM155R71E104KE14; Type: CHIP-0402; Tolerance: 10%; Диэлектрик: X7R; Data: 01-15-2018
R103-R105 = RC0402FR-0722RL: Резистор CHIP-0402 22 Ом 1%; Manufacturer: YAGEO; ID: 272; ТКС: 100 ppm/K; Температура: -55...+155°C; Autor: Цислав А.Н.; PartNumber: RC0402FR-0722RL; Type: CHIP-0402; Tolerance: 1%; Data: 02-03-2014
X17 = 2199230-4: Разъем TE M.2 NGFF; ID: 339; Contact: 75; Pitch: 0.5 мм; Current: 100 мА; Autor: Admin; PartNumber: 2199230-4; Type: M.2; Mounting: Поверхностный; Manufacturer: TE; Data: 11-21-2023

## Sheet 8 Clock buffer.SchDoc
size 420 x 297 mm; SheetNumber: 9; SheetTotal: 9
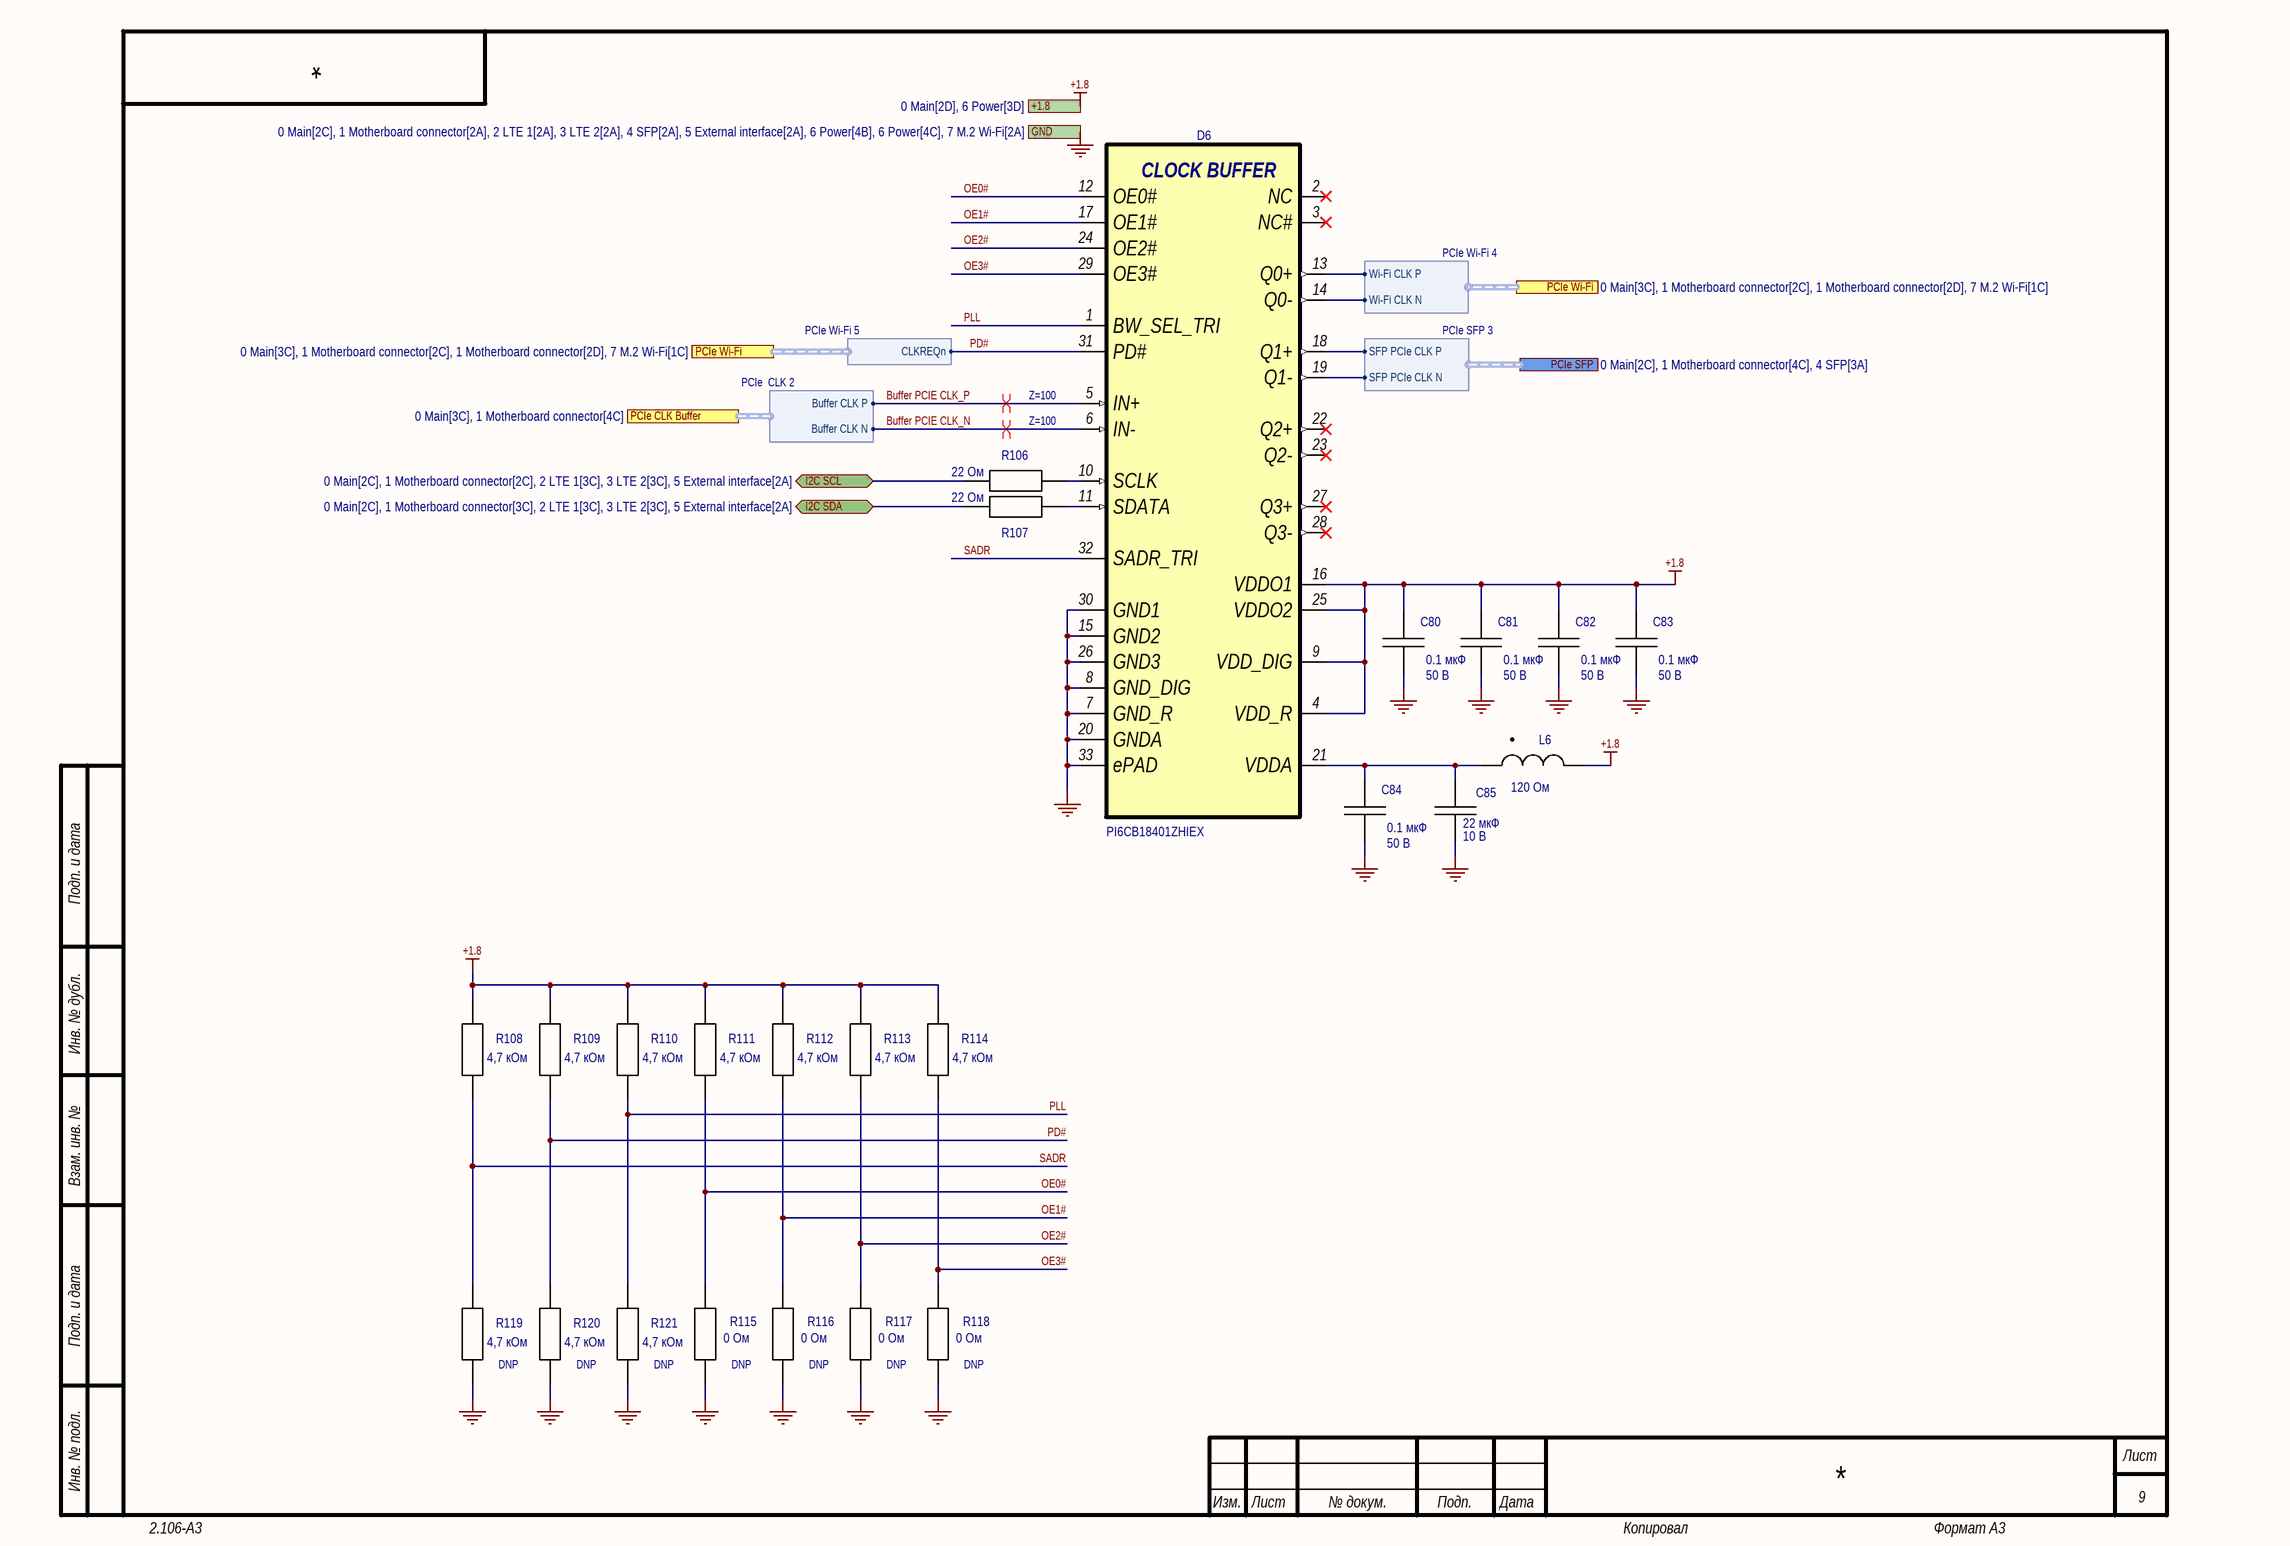
[diagram p8: 8 Clock buffer.SchDoc]

### Parts
C80  value 0.1 мкФ  Напряжение: 50 В  [CAP_0402]
C81  value 0.1 мкФ  Напряжение: 50 В  [CAP_0402]
C82  value 0.1 мкФ  Напряжение: 50 В  [CAP_0402]
C83  value 0.1 мкФ  Напряжение: 50 В  [CAP_0402]
C84  value 0.1 мкФ  Напряжение: 50 В  [CAP_0402]
C85  value 22 мкФ  Напряжение: 10 В  [CAP_0603]
D6  PI6CB18401ZHIEX  [TQFN-32]
L6  value 120 Ом  [IND_0402]  (hidden comment: STD_IND)
R106  value 22 Ом  [RES_0402]  (hidden comment: STD_RES)
R107  value 22 Ом  [RES_0402]  (hidden comment: STD_RES)
R108  value 4,7 кОм  [RES_0402]  (hidden comment: STD_RES)
R109  value 4,7 кОм  [RES_0402]  (hidden comment: STD_RES)
R110  value 4,7 кОм  [RES_0402]  (hidden comment: STD_RES)
R111  value 4,7 кОм  [RES_0402]  (hidden comment: STD_RES)
R112  value 4,7 кОм  [RES_0402]  (hidden comment: STD_RES)
R113  value 4,7 кОм  [RES_0402]  (hidden comment: STD_RES)
R114  value 4,7 кОм  [RES_0402]  (hidden comment: STD_RES)
R115  value 0 Ом  [RES_0402]  (hidden comment: STD_RES)
R116  value 0 Ом  [RES_0402]  (hidden comment: STD_RES)
R117  value 0 Ом  [RES_0402]  (hidden comment: STD_RES)
R118  value 0 Ом  [RES_0402]  (hidden comment: STD_RES)
R119  value 4,7 кОм  [RES_0402]  (hidden comment: STD_RES)
R120  value 4,7 кОм  [RES_0402]  (hidden comment: STD_RES)
R121  value 4,7 кОм  [RES_0402]  (hidden comment: STD_RES)

### Ports
+1.8 (see 0 Main[2D], 6 Power[3D]), GND (see 0 Main[2C], 1 Motherboard connector[2A], 2 LTE 1[2A], 3 LTE 2[2A], 4 SFP[2A], 5 External interface[2A], 6 Power[4B], 6 Power[4C], 7 M.2 Wi-Fi[2A]), I2C SCL (bidir, see 0 Main[2C], 1 Motherboard connector[2C], 2 LTE 1[3C], 3 LTE 2[3C], 5 External interface[2A]), I2C SDA (bidir, see 0 Main[2C], 1 Motherboard connector[3C], 2 LTE 1[3C], 3 LTE 2[3C], 5 External interface[2A]), PCIe CLK Buffer (harness PCIe  CLK 2, see 0 Main[3C], 1 Motherboard connector[4C]), PCIe SFP (harness PCIe SFP 3, see 0 Main[2C], 1 Motherboard connector[4C], 4 SFP[3A]), PCIe Wi-Fi (harness PCIe Wi-Fi 4, see 0 Main[3C], 1 Motherboard connector[2C], 1 Motherboard connector[2D], 7 M.2 Wi-Fi[1C]), PCIe Wi-Fi (harness PCIe Wi-Fi 5, see 0 Main[3C], 1 Motherboard connector[2C], 1 Motherboard connector[2D], 7 M.2 Wi-Fi[1C])

### Harnesses
PCIe Wi-Fi 4: Wi-Fi CLK P, Wi-Fi CLK N
PCIe SFP 3: SFP PCIe CLK P, SFP PCIe CLK N
PCIe Wi-Fi 5: CLKREQn
PCIe  CLK 2: Buffer CLK P, Buffer CLK N

### Nets
+1.8: C80.1 C81.1 C82.1 C83.1 D6.4(VDD_R) D6.9(VDD_DIG) D6.16(VDDO1) D6.25(VDDO2) L6.2 R108.2 R109.2 R110.2 R111.2 R112.2 R113.2 R114.2 ; port +1.8
GND: C80.2 C81.2 C82.2 C83.2 C84.2 C85.2 D6.7(GND_R) D6.8(GND_DIG) D6.15(GND2) D6.20(GNDA) D6.26(GND3) D6.30(GND1) D6.33(ePAD) R115.1 R116.1 R117.1 R118.1 R119.1 R120.1 R121.1 ; port GND
Buffer PCIE CLK_N: D6.6(IN-) ; port PCIe CLK Buffer.Buffer CLK N
Buffer PCIE CLK_P: D6.5(IN+) ; port PCIe CLK Buffer.Buffer CLK P
OE0#: D6.12(OE0#) R111.1 R115.2
OE1#: D6.17(OE1#) R112.1 R116.2
OE2#: D6.24(OE2#) R113.1 R117.2
OE3#: D6.29(OE3#) R114.1 R118.2
PD#: D6.31(PD#) R109.1 R120.2 ; port PCIe Wi-Fi.CLKREQn
PLL: D6.1(BW_SEL_TRI) R110.1 R121.2
SADR: D6.32(SADR_TRI) R108.1 R119.2
SFP CLK_N: D6.19(Q1-) ; port PCIe SFP.SFP PCIe CLK N
SFP CLK_P: D6.18(Q1+) ; port PCIe SFP.SFP PCIe CLK P
Wi-Fi PCIe CLK_N: D6.14(Q0-) ; port PCIe Wi-Fi.Wi-Fi CLK N
Wi-Fi PCIe CLK_P: D6.13(Q0+) ; port PCIe Wi-Fi.Wi-Fi CLK P
NetC84_1: C84.1 C85.1 D6.21(VDDA) L6.1
NetD1_5: R107.2 ; port I2C SDA
NetD1_6: R106.2 ; port I2C SCL
NetD6_10: D6.10(SCLK) R106.1
NetD6_11: D6.11(SDATA) R107.1

Not connected (* = marked no-connect by the designer): D6 2(NC)* 3(NC#)* 22(Q2+)* 23(Q2-)* 27(Q3+)* 28(Q3-)*

### Layout directives
differential pair; differential pair class Z=100: Buffer PCIE CLK_N, Buffer PCIE CLK_P

### Notes on the sheet
- DNP
- (near R118) DNP
- Подп. и дата
- Инв. № дубл.
- Взам. инв. №
- Инв. № подл.
- Изм.
- Лист
- № докум.
- Подп.
- Дата
- 2.106-A3
- Копировал
- Формат А3
- (in symbol PI6CB18401ZHIEX) CLOCK BUFFER

### Library data of the parts
C80-C84 = CC0402KRX7R9BB104: Конденсатор CHIP-0402 0.1 мкФ 50 В 10% X7R; Manufacturer: YAGEO; ID: 357; Температура: -55...+85°C; Autor: Admin; PartNumber: CC0402KRX7R9BB104; Type: CHIP-0402; Tolerance: 10%; Диэлектрик: X7R; Data: 10-04-2024
C85 = GRM188R61A226ME15: Конденсатор CHIP-0603 22 мкФ 10 В 20% X5R; Manufacturer: MURATA; ID: 233; Температура: -55...+85°C; Autor: Admin; PartNumber: GRM188R61A226ME15; Type: CHIP-0603; Tolerance: 20%; Диэлектрик: X5R; Data: 01-05-2018
D6 = PI6CB18401ZHIEX: Микросхема Diodes  HCSL Fanout Buffer; ID: 820; Type: Interfaces; Voltage: 3,3В; Current: 40 мА; Температура: -40...+85°C; Autor: Admin; PartNumber: PI6CB18401ZHIEX; Value: HCSL Fanout Buffer; Manufacturer: Diodes; Data: 12-05-2024
L6 = BLM15AG121SN1D: Катушка индуктивности BEAD-0402 120 Ом 25%; Manufacturer: MURATA; ID: 234; Current: 550 мА; Температура: -40...+85°C; Autor: Admin; PartNumber: BLM15AG121SN1D; Type: BEAD-0402; Tolerance: 25%; Data: 10-18-2024
R106 R107 = RC0402FR-0722RL: as R103-R105 on sheet 7 M.2 Wi-Fi; PartNumber: RC0402FR-0722RL; Type: CHIP-0402; Tolerance: 1%; Data: 02-03-2014
R108-R114 R119-R121 = RC0402FR-074K7L: Резистор CHIP-0402 4,7 кОм 1%; Manufacturer: YAGEO; ID: 381; ТКС: 100 ppm/K; Температура: -55...+155°C; Autor: Цислав А.Н.; PartNumber: RC0402FR-074K7L; Type: CHIP-0402; Tolerance: 1%; Data: 02-03-2014
R115-R118 = RC0402JR-070RL: Резистор CHIP-0402 0 Ом 5%; Manufacturer: YAGEO; ID: 236; ТКС: 100 ppm/K; Температура: -55...+85°C; Autor: Admin; PartNumber: RC0402JR-070RL; Type: CHIP-0402; Tolerance: 5%; Data: 04-22-2025

## Nets that join several sheets
+1.8: 6 Power (C71.1 C72.1 D5.2), 8 Clock buffer (16 pins)
+3.3: 2 LTE 1 (12 pins), 6 Power (9 pins), 3 LTE 2 (12 pins), 4 SFP (L1.1 R47.1 R49.2 R50.2), 5 External interface (10 pins), 1 Motherboard connector (7 pins), 7 M.2 Wi-Fi (8 pins)
GND: 2 LTE 1 (25 pins), 6 Power (40 pins), 3 LTE 2 (25 pins), 4 SFP (41 pins), 5 External interface (28 pins), 1 Motherboard connector (17 pins), 7 M.2 Wi-Fi (15 pins), 8 Clock buffer (20 pins)
GNDG: 6 Power (C69.2 R102.2 X16.0), 4 SFP (20 pins), 5 External interface (X13.0 X14.9)
Buffer PCIE CLK_N: 1 Motherboard connector (X1.14), 8 Clock buffer (D6.6)
Buffer PCIE CLK_P: 1 Motherboard connector (X1.13), 8 Clock buffer (D6.5)
NetC48_1: 4 SFP (DD1.17), 5 External interface (C48.1 R78.1 R80.1), 1 Motherboard connector (X1.50 X1.58), 7 M.2 Wi-Fi (R103.2)
NetD1_5: 2 LTE 1 (R11.2 X3.32), 3 LTE 2 (X7.32), 5 External interface (D1.5), 1 Motherboard connector (R2.1 X1.19), 8 Clock buffer (R107.2)
NetD1_6: 2 LTE 1 (R9.2 X3.30), 3 LTE 2 (X7.30), 5 External interface (D1.6), 1 Motherboard connector (R1.1 X1.49), 8 Clock buffer (R106.2)
NetDD1_16: 4 SFP (DD1.16), 1 Motherboard connector (X1.51 X1.57), 7 M.2 Wi-Fi (R105.2)
NetDD1_34: 4 SFP (DD1.34 R52.2), 1 Motherboard connector (X1.47)
NetDD1_35: 4 SFP (DD1.35 R51.2), 1 Motherboard connector (X1.56)
NetDD1_36: 4 SFP (DD1.36 R53.2), 1 Motherboard connector (X1.46)
NetDD3_8: 5 External interface (DD3.8), 1 Motherboard connector (X1.34)
NetDD3_9: 5 External interface (DD3.9), 1 Motherboard connector (X1.4)
NetR8_1: 2 LTE 1 (R8.1), 1 Motherboard connector (X1.26)
NetR18_1: 3 LTE 2 (R18.1), 1 Motherboard connector (X1.27)
NetR67_2: 5 External interface (R67.2), 1 Motherboard connector (X1.32)
NetR73_2: 5 External interface (R73.2), 1 Motherboard connector (X1.2)
NetR82_1: 5 External interface (R82.1), 1 Motherboard connector (X1.3)
NetR83_1: 5 External interface (R83.1), 1 Motherboard connector (X1.33)
NetSB1_1: 5 External interface (SB1.1), 1 Motherboard connector (X1.28)
PD#: 7 M.2 Wi-Fi (R104.2), 8 Clock buffer (D6.31 R109.1 R120.2)
SFP CLK_N: 4 SFP (DD1.25), 8 Clock buffer (D6.19)
SFP CLK_P: 4 SFP (DD1.26), 8 Clock buffer (D6.18)
SFP RX INT_N: 4 SFP (C19.2), 1 Motherboard connector (X1.10)
SFP RX INT_P: 4 SFP (C18.2), 1 Motherboard connector (X1.11)
SFP TX INT_N: 4 SFP (C23.2), 1 Motherboard connector (X1.8)
SFP TX INT_P: 4 SFP (C20.2), 1 Motherboard connector (X1.9)
USB LTE1_N: 2 LTE 1 (X3.36), 1 Motherboard connector (DA1.5)
USB LTE1_P: 2 LTE 1 (X3.38), 1 Motherboard connector (DA1.6)
USB LTE2_N: 3 LTE 2 (X7.36), 1 Motherboard connector (DA1.7)
USB LTE2_P: 3 LTE 2 (X7.38), 1 Motherboard connector (DA1.8)
USB Wi-Fi_N: 1 Motherboard connector (DA1.3), 7 M.2 Wi-Fi (X17.3)
USB Wi-Fi_P: 1 Motherboard connector (DA1.4), 7 M.2 Wi-Fi (X17.5)
Wi-Fi PCIe CLK_N: 7 M.2 Wi-Fi (X17.49), 8 Clock buffer (D6.14)
Wi-Fi PCIe CLK_P: 7 M.2 Wi-Fi (X17.47), 8 Clock buffer (D6.13)
Wi-Fi PCIe RX_N: 1 Motherboard connector (X1.40), 7 M.2 Wi-Fi (X17.43)
Wi-Fi PCIe RX_P: 1 Motherboard connector (X1.41), 7 M.2 Wi-Fi (X17.41)
Wi-Fi PCIe TX int_N: 1 Motherboard connector (X1.38), 7 M.2 Wi-Fi (C77.2)
Wi-Fi PCIe TX int_P: 1 Motherboard connector (X1.39), 7 M.2 Wi-Fi (C76.2)

## Assembly variants
V1: not fitted R47 R62 R64 R69 R75 R79 R111 R112 R115 R116 R117 R118 R120 R121